# Altium schematic sheet DSO_ADC.SchDoc: Schematic_Name
size A4; CompanyName: University of Melbourne; Engineer: Your Name Here; DocumentNumber: 1; Revision: 0.1; SheetNumber: 1; SheetTotal: 1; Title_Project: Project_Title; StudentNo: Student No.
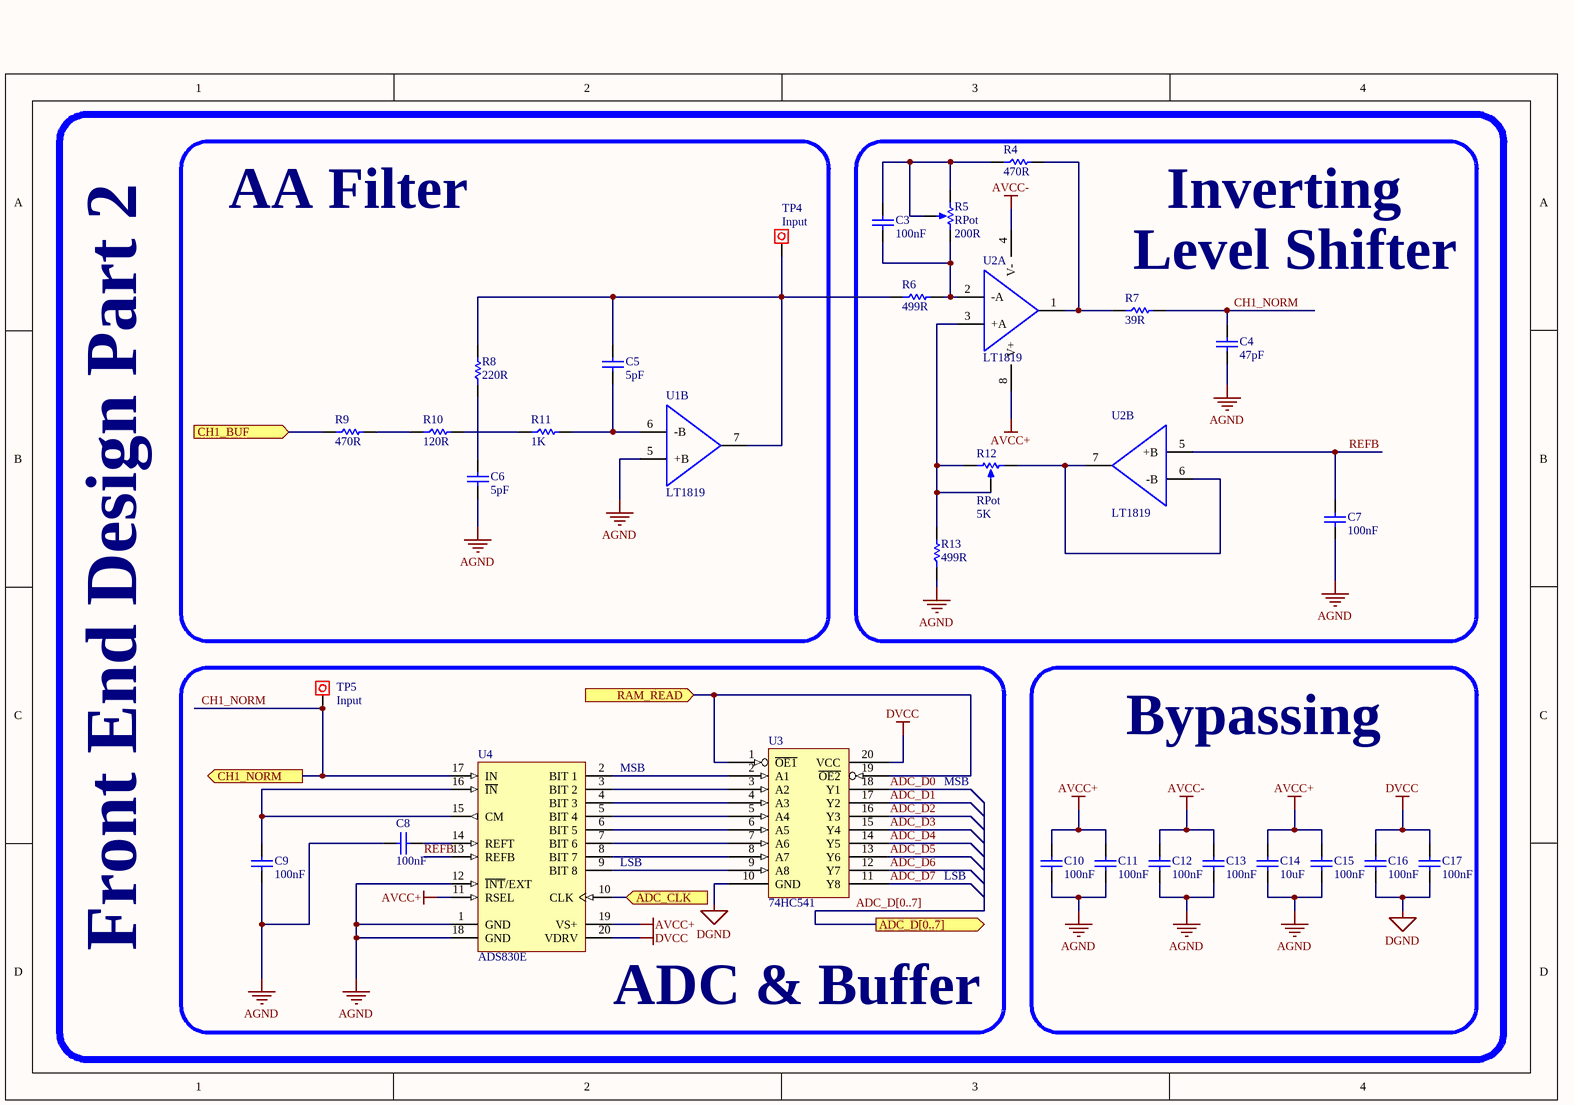
[diagram p0: DSO_ADC.SchDoc]

## Parts
C3  100nF  [0805C]
C4  47pF  [0805C]
C5  5pF  [0805C]
C6  5pF  [0805C]
C7  100nF  [0805C]
C8  100nF  [0805C]
C9  100nF  [0805C]
C10  100nF  [0805C]
C11  100nF  [0805C]
C12  100nF  [0805C]
C13  100nF  [0805C]
C14  10uF  [0805C]
C15  100nF  [0805C]
C16  100nF  [0805C]
C17  100nF  [0805C]
R4  470R  [0805]
R5  RPot  value 200R  [VR5]
R6  499R  [0805]
R7  39R  [0805]
R8  220R  [0805]
R9  470R  [0805]
R10  120R  [0805]
R11  1K  [0805]
R12  RPot  value 5K  [VR5]
R13  499R  [0805]
TP4  INPUT  [Testpoin]
TP5  INPUT  [Testpoin]
U1  LT1819  [SOIC-8]  (part B of 2)
U2  LT1819  [SOIC-8]  (parts A,B of 2)
U3  74HC541  [SOT163-1_N]
U4  ADS830E  [TI-DBQ20_L]

## Blocks framed on the sheet
AA Filter: C5 C6 R8-R11 TP4 U1
ADC & Buffer: C8 C9 TP5 U3 U4
Bypassing: C10-C17

## Ports
ADC_CLK (in), ADC_D[0..7] (out), CH1_BUF (in), CH1_NORM (out), RAM_READ (in)

## Nets
AGND: C4.2 C6.2 C7.2 C8.2 C9.1 C10.1 C11.1 C12.1 C13.1 C14.1 C15.1 R13.1 U1.5(+B) U4.1(GND) U4.12(~{INT}/EXT) U4.18(GND)
AVCC+: C10.2 C11.2 C14.2 C15.2 U2.8(V+) U4.11(RSEL) U4.19(VS+)
AVCC-: C12.2 C13.2 U2.4(V-)
DGND: C16.1 C17.1 U3.10(GND)
DVCC: C16.2 C17.2 U3.20(VCC) U4.20(VDRV)
ADC_CLK: U4.10(CLK) ; port ADC_CLK
ADC_D0: U3.18(Y1)
ADC_D1: U3.17(Y2)
ADC_D2: U3.16(Y3)
ADC_D3: U3.15(Y4)
ADC_D4: U3.14(Y5)
ADC_D5: U3.13(Y6)
ADC_D6: U3.12(Y7)
ADC_D7: U3.11(Y8)
CH1_BUF: R9.1 ; port CH1_BUF
CH1_NORM: C4.1 R7.2 TP5.1 U4.17(IN) ; port CH1_NORM
RAM_READ: U3.1(~{OE1}) U3.19(~{OE2}) ; port RAM_READ
REFB: C7.1 U2.5(+B) U4.13(REFB)
NetC3_1: C3.1 R4.1 R5.1(TOP) R5.2(TAP)
NetC3_2: C3.2 R5.3(BOT) R6.2 U2.2(-A)
NetC5_1: C5.1 R6.1 R8.2 TP4.1 U1.7(OUTB)
NetC5_2: C5.2 R11.2 U1.6(-B)
NetC6_1: C6.1 R8.1
NetC8_1: C8.1 U4.14(REFT)
NetC9_2: C9.2 U4.15(CM) U4.16(~{IN})
NetR4_2: R4.2 R7.1 U2.1(OUTA)
NetR9_2: R9.2 R10.1
NetR10_2: R10.2 R11.1
NetR12_1: R12.1(TOP) R12.2(TAP) R13.2 U2.3(+A)
NetR12_3: R12.3(BOT) U2.6(-B) U2.7(OUTB)
NetU3_2: U3.2(A1) U4.2(BIT_1)
NetU3_3: U3.3(A2) U4.3(BIT_2)
NetU3_4: U3.4(A3) U4.4(BIT_3)
NetU3_5: U3.5(A4) U4.5(BIT_4)
NetU3_6: U3.6(A5) U4.6(BIT_5)
NetU3_7: U3.7(A6) U4.7(BIT_6)
NetU3_8: U3.8(A7) U4.8(BIT_7)
NetU3_9: U3.9(A8) U4.9(BIT_8)

## Buses and harness runs
bus ADC_D[0..7] = port ADC_D[0..7]

## Notes on the sheet
- Inverting
- (near R7) Level Shifter
- (near U4) MSB
- MSB
- (near U4) LSB
- LSB
- Front End Design Part 2

## Library data of the parts
C3-C17 = C: Capacitor; Reviewed by: RM - 2018/08/05; Revision: July-2002: Re-released for DXP Platform.; Supplier 1: *; Supplier Part Number 1: *
  C3 C7-C13 C15-C17: Value: 100nF
  C4: Value: 47pF
  C5 C6: Value: 5pF
  C14: Value: 10uF
R4 R6-R11 R13 = R: Resistor; Reviewed by: RM - 2018/08/05; Supplier 1: *; Suppler Part Number 1: *
  R4 R9: Value: 470R
  R6 R13: Value: 499R
  R7: Value: 39R
  R8: Value: 220R
  R10: Value: 120R
  R11: Value: 1K
R5 R12 = RPot: Potentiometer; Sim Note: Enter the Resistance value and the set point into parameter fields.; Set Position: 0.5; Published: 8-Jun-2000; LatestRevisionDate: 17-Jul-2002; LatestRevisionNote: Re-released for DXP Platform.; PackageReference: VR5; Publisher: Altium Limited; PackageDescription: Variable Resistor, Thru-Hole; 3 Leads
TP4 TP5 = Test Point: Pad; Value: Input
U1 U2 = LT1819: OpAmp High Frequency Dual; Reviewed by: RM - 2018/08/05; Supplier 1: Digi-Key; Supplier Part Number 1: LT1819CMS8#PBF-ND
U3 = 74HC541: (ADV) Octal Buffer, Line Driver; Reviewed by: RM - 2018/08/05; Supplier 1: Digi-Key; Supplier Part Number 1: 296-1202-1-ND
U4 = ADS830E: 8-Bit, 60 MSPS ADC Single-Ended / Differential Input, Internal / External Reference and Programmble Input Range, -40 to 85 degC, 20-pin SOP (DBQ20), Green (RoHS & no Sb/Br); Reviewed by: RM - 2018/08/05; ComponentLink2URL: http://www.ti.com/general/docs/lit/getliterature.tsp?genericPartNumber=ADS830&fileType=pdf; ComponentLink2Description: Datasheet; ComponentLink1URL: http://www.ti.com/; ComponentLink3URL: http://www.ti.com/litv/pdf/mpds210a; ComponentLink3Description: Package Specification; ComponentLink1Description: Manufacturer URL; Supplier 1: Digi-Key; Supplier Part Number 1: ADS830E-ND